# EAGLE design AteGates (EAGLE 6.6.0)
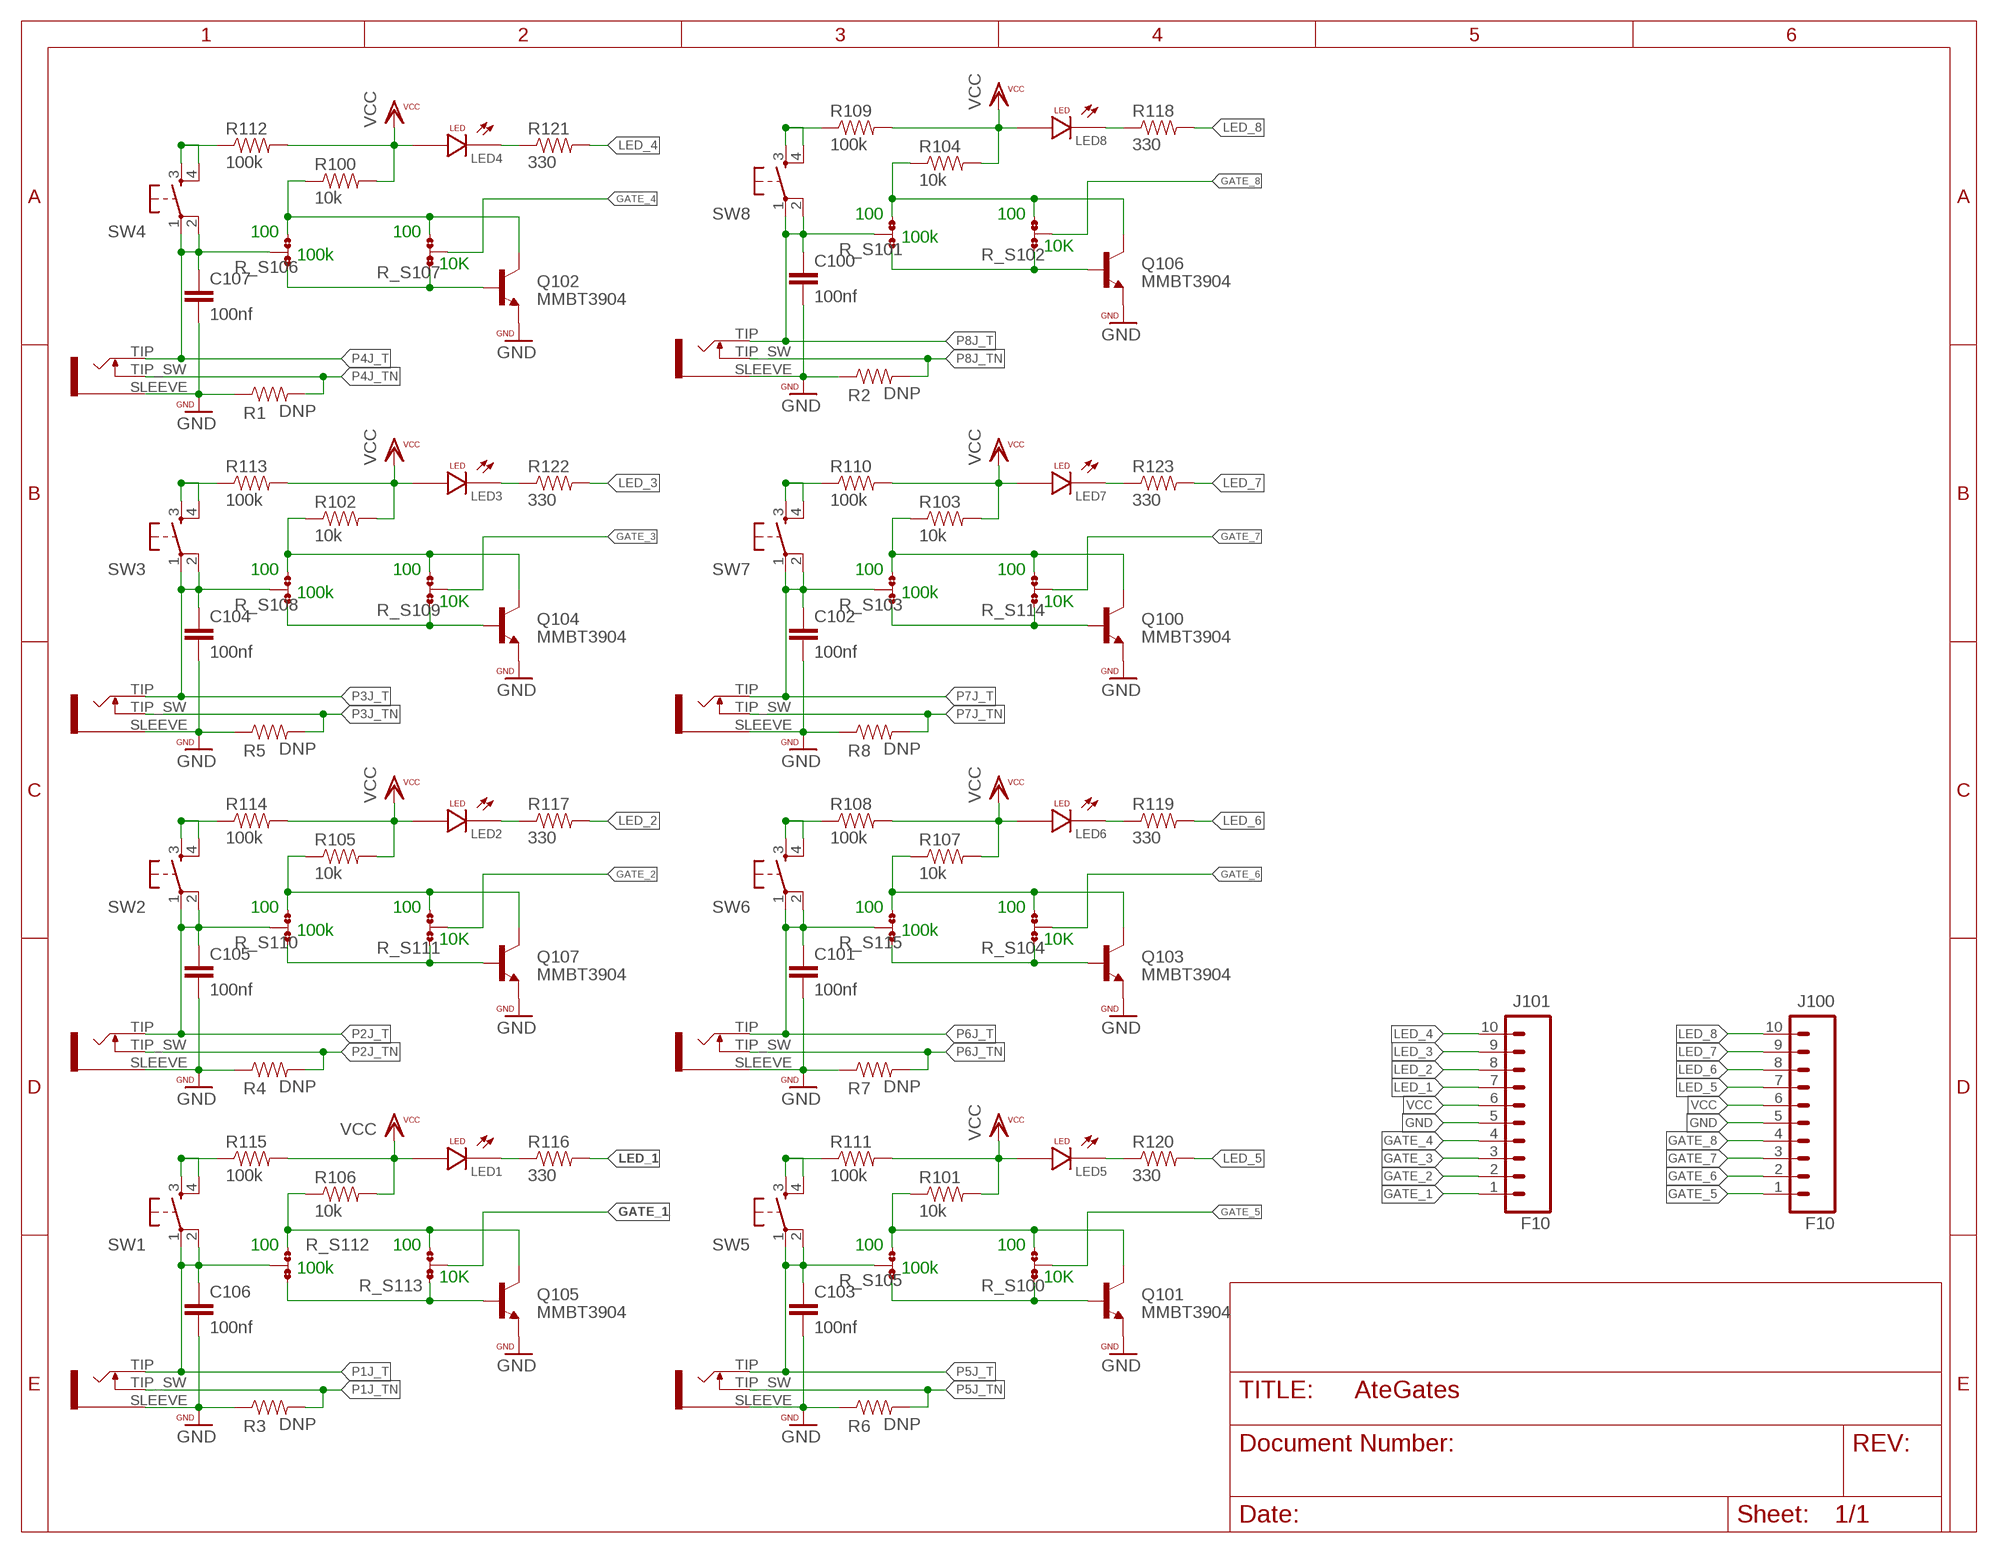
[diagram p0: schematic, sheet 1]

## Parts
C100  100nf  CAP0603-CAP  [0603-CAP]
C101  100nf  CAP0603-CAP  [0603-CAP]
C102  100nf  CAP0603-CAP  [0603-CAP]
C103  100nf  CAP0603-CAP  [0603-CAP]
C104  100nf  CAP0603-CAP  [0603-CAP]
C105  100nf  CAP0603-CAP  [0603-CAP]
C106  100nf  CAP0603-CAP  [0603-CAP]
C107  100nf  CAP0603-CAP  [0603-CAP]
J100  F10  M10SILK_FEMALE_PTH  [1X10_OCTO]
J101  F10  M10SILK_FEMALE_PTH  [1X10_OCTO]
LED1  LED  [LED3MM]
LED2  LED  [LED3MM]
LED3  LED  [LED3MM]
LED4  LED  [LED3MM]
LED5  LED  [LED3MM]
LED6  LED  [LED3MM]
LED7  LED  [LED3MM]
LED8  LED  [LED3MM]
P1J  JACK-3_5MM-MONO-SW-WQP_PJ302-12  [WQP_PJ301M-12]
P2J  JACK-3_5MM-MONO-SW-WQP_PJ302-12  [WQP_PJ301M-12]
P3J  JACK-3_5MM-MONO-SW-WQP_PJ302-12  [WQP_PJ301M-12]
P4J  JACK-3_5MM-MONO-SW-WQP_PJ302-12  [WQP_PJ301M-12]
P5J  JACK-3_5MM-MONO-SW-WQP_PJ302-12  [WQP_PJ301M-12]
P6J  JACK-3_5MM-MONO-SW-WQP_PJ302-12  [WQP_PJ301M-12]
P7J  JACK-3_5MM-MONO-SW-WQP_PJ302-12  [WQP_PJ301M-12]
P8J  JACK-3_5MM-MONO-SW-WQP_PJ302-12  [WQP_PJ301M-12]
Q100  MMBT3904  MMBT3904LT1-NPN-SOT23-BEC  [SOT23-BEC]
Q101  MMBT3904  MMBT3904LT1-NPN-SOT23-BEC  [SOT23-BEC]
Q102  MMBT3904  MMBT3904LT1-NPN-SOT23-BEC  [SOT23-BEC]
Q103  MMBT3904  MMBT3904LT1-NPN-SOT23-BEC  [SOT23-BEC]
Q104  MMBT3904  MMBT3904LT1-NPN-SOT23-BEC  [SOT23-BEC]
Q105  MMBT3904  MMBT3904LT1-NPN-SOT23-BEC  [SOT23-BEC]
Q106  MMBT3904  MMBT3904LT1-NPN-SOT23-BEC  [SOT23-BEC]
Q107  MMBT3904  MMBT3904LT1-NPN-SOT23-BEC  [SOT23-BEC]
R1  DNP  RESISTOR0603-RES  [0603-RES]
R2  DNP  RESISTOR0603-RES  [0603-RES]
R3  DNP  RESISTOR0603-RES  [0603-RES]
R4  DNP  RESISTOR0603-RES  [0603-RES]
R5  DNP  RESISTOR0603-RES  [0603-RES]
R6  DNP  RESISTOR0603-RES  [0603-RES]
R7  DNP  RESISTOR0603-RES  [0603-RES]
R8  DNP  RESISTOR0603-RES  [0603-RES]
R100  10k  RESISTOR0603-RES  [0603-RES]
R101  10k  RESISTOR0603-RES  [0603-RES]
R102  10k  RESISTOR0603-RES  [0603-RES]
R103  10k  RESISTOR0603-RES  [0603-RES]
R104  10k  RESISTOR0603-RES  [0603-RES]
R105  10k  RESISTOR0603-RES  [0603-RES]
R106  10k  RESISTOR0603-RES  [0603-RES]
R107  10k  RESISTOR0603-RES  [0603-RES]
R108  100k  RESISTOR0603-RES  [0603-RES]
R109  100k  RESISTOR0603-RES  [0603-RES]
R110  100k  RESISTOR0603-RES  [0603-RES]
R111  100k  RESISTOR0603-RES  [0603-RES]
R112  100k  RESISTOR0603-RES  [0603-RES]
R113  100k  RESISTOR0603-RES  [0603-RES]
R114  100k  RESISTOR0603-RES  [0603-RES]
R115  100k  RESISTOR0603-RES  [0603-RES]
R116  330  RESISTOR0603-RES  [0603-RES]
R117  330  RESISTOR0603-RES  [0603-RES]
R118  330  RESISTOR0603-RES  [0603-RES]
R119  330  RESISTOR0603-RES  [0603-RES]
R120  330  RESISTOR0603-RES  [0603-RES]
R121  330  RESISTOR0603-RES  [0603-RES]
R122  330  RESISTOR0603-RES  [0603-RES]
R123  330  RESISTOR0603-RES  [0603-RES]
R_S100  JMP-3-NO-0603  [JMP-3-NO-0603]
R_S101  100  JMP-3-NO-0603  [JMP-3-NO-0603]
R_S102  JMP-3-NO-0603  [JMP-3-NO-0603]
R_S103  100  JMP-3-NO-0603  [JMP-3-NO-0603]
R_S104  JMP-3-NO-0603  [JMP-3-NO-0603]
R_S105  100  JMP-3-NO-0603  [JMP-3-NO-0603]
R_S106  100  JMP-3-NO-0603  [JMP-3-NO-0603]
R_S107  JMP-3-NO-0603  [JMP-3-NO-0603]
R_S108  100  JMP-3-NO-0603  [JMP-3-NO-0603]
R_S109  JMP-3-NO-0603  [JMP-3-NO-0603]
R_S110  100  JMP-3-NO-0603  [JMP-3-NO-0603]
R_S111  JMP-3-NO-0603  [JMP-3-NO-0603]
R_S112  100  JMP-3-NO-0603  [JMP-3-NO-0603]
R_S113  JMP-3-NO-0603  [JMP-3-NO-0603]
R_S114  JMP-3-NO-0603  [JMP-3-NO-0603]
R_S115  100  JMP-3-NO-0603  [JMP-3-NO-0603]
SW1  TAC_SWITCHPTH  [TACTILE-PTH]
SW2  TAC_SWITCHPTH  [TACTILE-PTH]
SW3  TAC_SWITCHPTH  [TACTILE-PTH]
SW4  TAC_SWITCHPTH  [TACTILE-PTH]
SW5  TAC_SWITCHPTH  [TACTILE-PTH]
SW6  TAC_SWITCHPTH  [TACTILE-PTH]
SW7  TAC_SWITCHPTH  [TACTILE-PTH]
SW8  TAC_SWITCHPTH  [TACTILE-PTH]

## Nets
GATE_1: J101.1 R_S113.2
GATE_2: J101.2 R_S111.2
GATE_3: J101.3 R_S109.2
GATE_4: J101.4 R_S107.2
GATE_5: J100.1 R_S100.2
GATE_6: J100.2 R_S104.2
GATE_7: J100.3 R_S114.2
GATE_8: J100.4 R_S102.2
GND: C100.2 C101.2 C102.2 C103.2 C104.2 C105.2 C106.2 C107.2 J100.5 J101.5 P1J.SLEEVE P2J.SLEEVE P3J.SLEEVE P4J.SLEEVE P5J.SLEEVE P6J.SLEEVE P7J.SLEEVE P8J.SLEEVE Q100.E Q101.E Q102.E Q103.E Q104.E Q105.E Q106.E Q107.E R1.1 R2.1 R3.1 R4.1 R5.1 R6.1 R7.1 R8.1
GTI_1_LEDK: LED1.K(CATHODE) R116.1
GTI_1_LEDK1: LED2.K(CATHODE) R117.1
GTI_1_LEDK2: LED3.K(CATHODE) R122.1
GTI_1_LEDK3: LED4.K(CATHODE) R121.1
GTI_1_LEDK4: LED5.K(CATHODE) R120.1
GTI_1_LEDK5: LED6.K(CATHODE) R119.1
GTI_1_LEDK6: LED7.K(CATHODE) R123.1
GTI_1_LEDK7: LED8.K(CATHODE) R118.1
LED_1: J101.7 R116.2
LED_2: J101.8 R117.2
LED_3: J101.9 R122.2
LED_4: J101.10 R121.2
LED_5: J100.7 R120.2
LED_6: J100.8 R119.2
LED_7: J100.9 R123.2
LED_8: J100.10 R118.2
P1J_T: C106.1 P1J.TIP R_S112.2 SW1.1 SW1.2
P1J_TN: P1J.TIP_SW R3.2
P2J_T: C105.1 P2J.TIP R_S110.2 SW2.1 SW2.2
P2J_TN: P2J.TIP_SW R4.2
P3J_T: C104.1 P3J.TIP R_S108.2 SW3.1 SW3.2
P3J_TN: P3J.TIP_SW R5.2
P4J_T: C107.1 P4J.TIP R_S106.2 SW4.1 SW4.2
P4J_TN: P4J.TIP_SW R1.2
P5J_T: C103.1 P5J.TIP R_S105.2 SW5.1 SW5.2
P5J_TN: P5J.TIP_SW R6.2
P6J_T: C101.1 P6J.TIP R_S115.2 SW6.1 SW6.2
P6J_TN: P6J.TIP_SW R7.2
P7J_T: C102.1 P7J.TIP R_S103.2 SW7.1 SW7.2
P7J_TN: P7J.TIP_SW R8.2
P8J_T: C100.1 P8J.TIP R_S101.2 SW8.1 SW8.2
P8J_TN: P8J.TIP_SW R2.2
Q1_B: Q105.B R_S112.3 R_S113.3
Q1_B1: Q107.B R_S110.3 R_S111.3
Q1_B2: Q104.B R_S108.3 R_S109.3
Q1_B3: Q102.B R_S106.3 R_S107.3
Q1_B4: Q101.B R_S100.3 R_S105.3
Q1_B5: Q103.B R_S104.3 R_S115.3
Q1_B6: Q100.B R_S103.3 R_S114.3
Q1_B7: Q106.B R_S101.3 R_S102.3
Q1_C: Q105.C R106.1 R_S112.1 R_S113.1
Q1_C1: Q107.C R105.1 R_S110.1 R_S111.1
Q1_C2: Q104.C R102.1 R_S108.1 R_S109.1
Q1_C3: Q102.C R100.1 R_S106.1 R_S107.1
Q1_C4: Q101.C R101.1 R_S100.1 R_S105.1
Q1_C5: Q103.C R107.1 R_S104.1 R_S115.1
Q1_C6: Q100.C R103.1 R_S103.1 R_S114.1
Q1_C7: Q106.C R104.1 R_S101.1 R_S102.1
SW1: R115.1 SW1.3 SW1.4
SW2: R114.1 SW2.3 SW2.4
SW3: R113.1 SW3.3 SW3.4
SW4: R112.1 SW4.3 SW4.4
SW5: R111.1 SW5.3 SW5.4
SW6: R108.1 SW6.3 SW6.4
SW7: R110.1 SW7.3 SW7.4
SW8: R109.1 SW8.3 SW8.4
VCC: J100.6 J101.6 LED1.A(ANODE) LED2.A(ANODE) LED3.A(ANODE) LED4.A(ANODE) LED5.A(ANODE) LED6.A(ANODE) LED7.A(ANODE) LED8.A(ANODE) R100.2 R101.2 R102.2 R103.2 R104.2 R105.2 R106.2 R107.2 R108.2 R109.2 R110.2 R111.2 R112.2 R113.2 R114.2 R115.2

## Notes on the sheet
- 100 | 100
- 100 | 100
- 100k
- 10K
- 100k
- 10K
- 100 | 100 | 100 | 100
- 100k | 100k
- 10K | 10K
- 100 | 100 | 100 | 100
- 100k | 100k
- 10K | 10K
- 100 | 100 | 100 | 100
- 100k | 100k
- 10K | 10K

## Library data of the parts
C100-C107 = PatternAgents-ProtoPads:CAP: Capacitor Standard 0603 ceramic capacitor, and 0.1" leaded capacitor.
J100 J101 = oXo_Connectors:M10: Header 10 Standard 10-pin 0.1" header. Use with straight break away headers (SKU : PRT-00116), right angle break away headers (PRT-00553), swiss pins (PRT-00743), machine pins (PRT-00117), and female headers (PRT-00115).; PROD_ID: CONN-11563
LED1-LED8 = halcyonmod_Optoelectronics:LED
P1J P2J P3J P4J P5J P6J P7J P8J = oXo_Connectors:JACK-3_5MM-MONO-SW: Jack, 3.5mm, RIght Angle, Though-Hole
Q100-Q107 = transistor:*-NPN-: NPN Transistror BF959 corrected 2008.03.06
R1-R8 R100-R123 = PatternAgents-ProtoPads:RESISTOR: Resistor Basic schematic elements and footprints for 0603, 1206, and PTH resistors.
R_S100-R_S115 = PatternAgents-ProtoPads:JMP-3-NO: Three Terminal Jumper - Normally Open All Pads Open (unconnected) PatternAgents ProtoPads Library Schematic and PCB layout libraries for design patterns by PatternAgents. For the CADSoft Eagle CAD program : http://www.cadsoftusa.com/download-eagle/ Source LBR : http://www.patternagents.com Github : https://github.com/PatternAgents License : http://creativecommons.org/licenses/by-sa/4.0/ (Creative Commons 4.0) THIS SOFTWARE IS PROVIDED BY THE CONTRIBUTORS "AS IS" AND WITHOUT ANY EXPRESS OR IMPLIED WARRANTIES, INCLUDING, BUT NOT LIMITED TO, THE IMPLIED WARRANTIES OF MERCHANTABILITY AND FITNESS FOR A PARTICULAR PURPOSE ARE DISCLAIMED. IN NO EVENT SHALL THE COPYRIGHT OWNER OR CONTRIBUTORS BE LIABLE FOR ANY DIRECT, INDIRECT, INCIDENTAL, SPECIAL, EXEMPLARY, OR CONSEQUENTIAL DAMAGES (INCLUDING, BUT NOT LIMITED TO, PROCUREMENT OF SUBSTITUTE GOODS OR SERVICES; LOSS OF USE, DATA, OR PROFITS; OR BUSINESS INTERRUPTION) HOWEVER CAUSED AND ON ANY THEORY OF LIABILITY, WHETHER IN CONTRACT, STRICT LIABILITY, OR TORT (INCLUDING NEGLIGENCE OR OTHERWISE) ARISING IN ANY WAY OUT OF THE USE OF THIS SOFTWARE, EVEN IF ADVISED OF THE POSSIBILITY OF SUCH DAMAGE.; BOM: EXCLUDE
SW1-SW8 = SparkFun:TAC_SWITCH: Momentary Switch Button commonly used for reset or general input. Spark Fun Electronics SKU : COM-00097

## Board
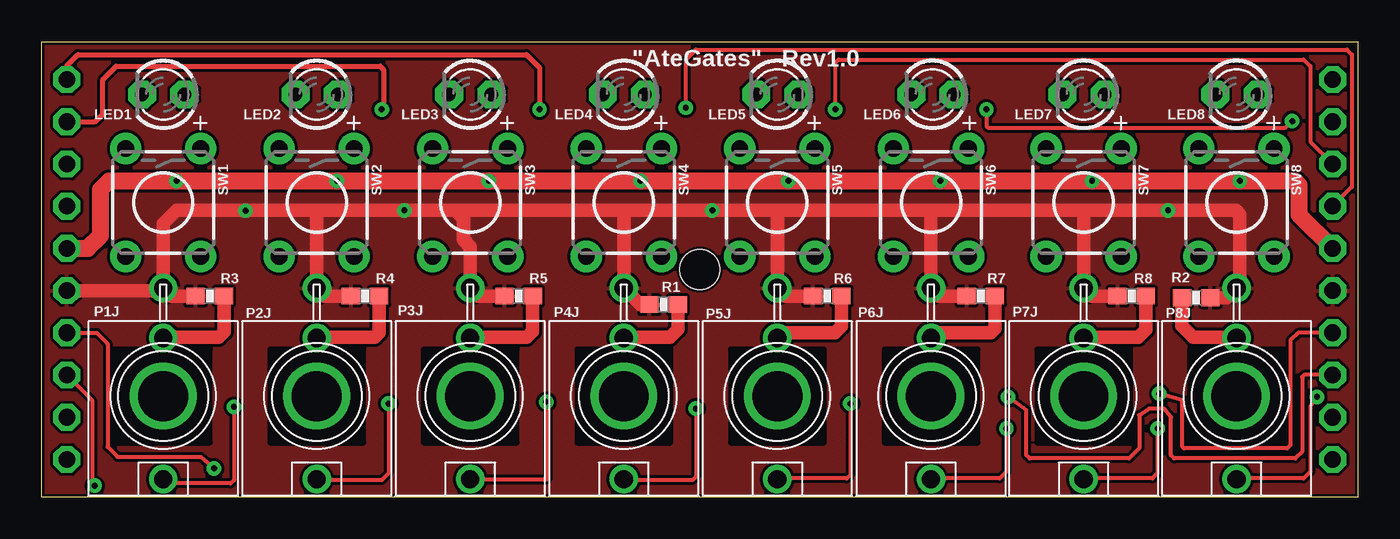
[diagram p1: board, top side]
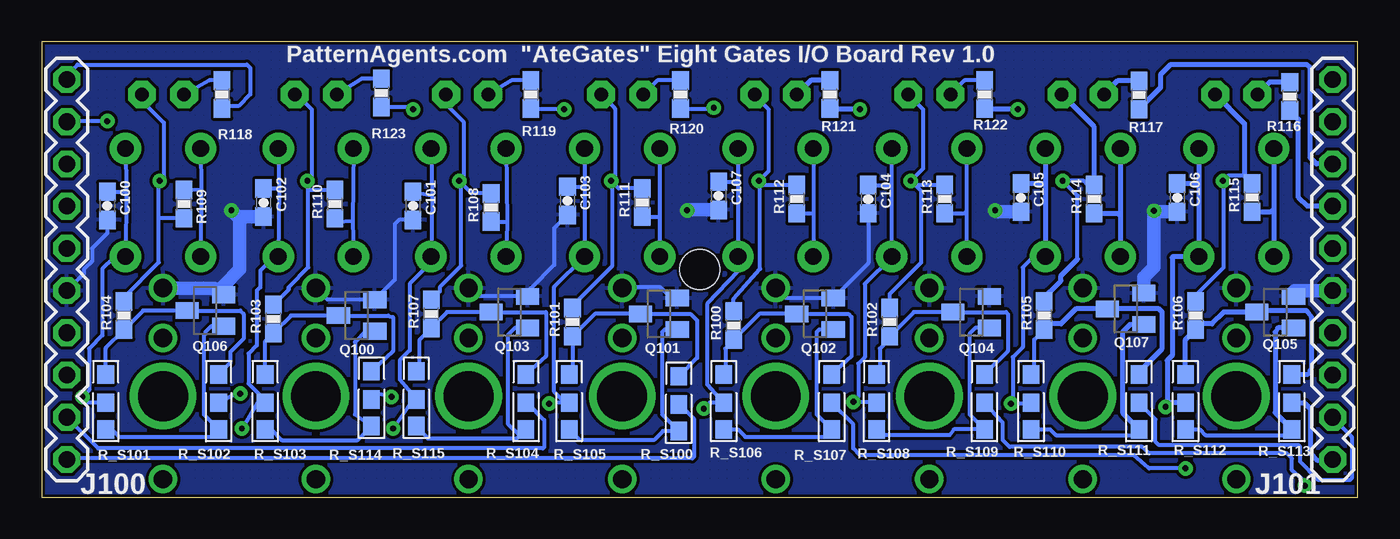
[diagram p2: board, bottom side, seen from below]

Size 79.25 x 27.43 mm. Coordinates in mm from the lower left corner, seen from the top.
Outline: 79.25,0 0,0 0,27.43 79.25,27.43 79.25,0
Copper layers (1*16): Top 0.035mm / dielectric 1.5mm / Bottom 0.035mm
Design rules "PatternAgents_7mil": minimum track width 7mil, minimum drill 14mil, track to track 7mil, track to pad 7mil, pad to pad 7mil, via to via 7mil, smd to smd 7mil, copper to edge 7mil, drill to drill 7mil, minimum pad ring 12mil, minimum via ring 10mil, stop-mask expansion 4mil, vias tented up to drill 25mil, thermal gap 7mil
Holes 2.4 mm at 39.62,13.72

### Footprints (pad centres in the part's own frame; a part is rotated, then mirrored left to right if it is on the bottom)
0603-CAP = smd 1.1 x 1: 1 -0.85,0; 2 0.85,0
1X10_OCTO = drill 1 octagon: 1 0,0; 2 2.54,0; 3 5.08,0; 4 7.62,0; 5 10.16,0; 6 12.7,0; 7 15.24,0; 8 17.78,0; 9 20.32,0; 10 22.86,0
LED3MM = drill 0.813 pad 1.676 octagon: A -1.27,0; K 1.27,0
WQP_PJ301M-12 = drill 3: HOLE 0,0 | drill 1.1: SLEEVE 0,-6.5; TIP 0,5; TIP_SW 0,-3.5
SOT23-BEC = smd 1 x 1.4: B -0.95,-1.1; C 0,1.1; E 0.95,-1.1
0603-RES = smd 1.1 x 1: 1 -0.85,0; 2 0.85,0
JMP-3-NO-0603 = smd 1.1 x 1: 1 -0.85,0; 2 0.85,0; 3 2.452,0
TACTILE-PTH = drill 1.016 pad 1.88: 1 -3.251,2.261; 2 3.251,2.261; 3 -3.251,-2.261; 4 3.251,-2.261

### Placement (x,y rotation side)
C100  75.28,17.55 270 bottom
C101  56.88,17.55 270 bottom
C102  65.88,17.75 270 bottom
C103  47.58,17.85 270 bottom
C104  29.48,17.95 270 bottom
C105  20.28,18.05 270 bottom
C106  10.88,18.05 270 bottom
C107  38.48,18.15 270 bottom
J100  77.72,2.29 90 bottom
J101  1.52,2.29 90 bottom
LED1  7.32,24.25 180 top
LED2  16.56,24.25 180 top
LED3  25.8,24.25 180 top
LED4  35.05,24.25 180 top
LED5  44.29,24.25 180 top
LED6  53.63,24.25 180 top
LED7  62.73,24.25 180 top
LED8  71.93,24.25 180 top
P1J  7.32,6.1 180 top
P2J  16.56,6.1 180 top
P3J  25.8,6.1 180 top
P4J  35.05,6.1 180 top
P5J  44.29,6.1 180 top
P6J  53.54,6.1 180 top
P7J  62.73,6.1 180 top
P8J  71.93,6.1 180 top
Q100  60.28,10.95 90 bottom
Q101  42.08,11.05 90 bottom
Q102  32.68,11.05 90 bottom
Q103  51.08,11.15 90 bottom
Q104  23.28,11.15 90 bottom
Q105  4.98,11.15 90 bottom
Q106  69.38,11.25 90 bottom
Q107  13.98,11.35 90 bottom
R1  37.45,11.6 0 top
R2  69.5,12.02 180 top
R3  10.14,12.11 0 top
R4  19.48,12.11 0 top
R5  28.72,12.11 0 top
R6  47.3,12.11 0 top
R7  56.55,12.11 0 top
R8  65.63,12.11 0 top
R100  37.58,10.35 90 bottom
R101  47.28,10.55 90 bottom
R102  28.18,10.55 90 bottom
R103  65.28,10.75 90 bottom
R104  74.28,10.95 90 bottom
R105  18.88,10.95 90 bottom
R106  9.78,10.95 90 bottom
R107  55.78,11.05 90 bottom
R108  52.18,17.45 90 bottom
R109  70.68,17.65 270 bottom
R110  61.58,17.65 90 bottom
R111  43.08,17.75 90 bottom
R112  33.78,17.95 90 bottom
R113  24.88,17.95 90 bottom
R114  15.88,17.95 90 bottom
R115  6.38,18.05 90 bottom
R116  4.1,24.13 270 bottom
R117  13.19,24.21 270 bottom
R118  68.38,24.25 270 bottom
R119  49.78,24.25 270 bottom
R120  40.78,24.25 270 bottom
R121  31.78,24.25 270 bottom
R122  22.48,24.25 270 bottom
R123  58.78,24.35 270 bottom
R_S100  40.88,6.45 270 bottom
R_S101  75.38,6.55 270 bottom
R_S102  68.58,6.55 270 bottom
R_S103  65.78,6.55 270 bottom
R_S104  50.08,6.55 270 bottom
R_S105  47.48,6.55 270 bottom
R_S106  38.18,6.55 270 bottom
R_S107  31.68,6.55 270 bottom
R_S108  28.98,6.55 270 bottom
R_S109  22.48,6.55 270 bottom
R_S110  19.68,6.55 270 bottom
R_S111  13.18,6.55 270 bottom
R_S112  10.38,6.55 270 bottom
R_S113  3.98,6.55 270 bottom
R_S114  59.38,6.75 270 bottom
R_S115  56.68,6.75 270 bottom
SW1  7.32,17.75 270 top
SW2  16.56,17.75 270 top
SW3  25.8,17.75 270 top
SW4  35.05,17.75 270 top
SW5  44.29,17.75 270 top
SW6  53.54,17.75 270 top
SW7  62.73,17.75 270 top
SW8  71.93,17.75 270 top

### Tracks (layer width: path | path; a pad name or v marks a point on that pad's centre or on a via)
GATE_1
  Bottom 0.305: R_S113.2 3.23,5.7 2.88,5.35 2.88,2.65 2.48,2.25 1.56,2.25 J101.1
GATE_2
  Bottom 0.254: J101.2 1.52,4.79 0.38,3.65 0.38,1.15 0.48,1.05 2.38,1.05 3.48,2.15 3.48,3.05 3.58,3.15 11.98,3.15 12.18,3.35 12.18,4.7 R_S111.2
GATE_3  (via drill 0.36)
  Top 0.254: J101.3 3.05,5.84 3.05,0.76 v3.2,0.71
  Bottom 0.254: v3.2,0.71 3.2,0.96 3.98,1.65 3.98,2.35 4.28,2.65 12.58,2.65 12.98,3.05 20.98,3.05 21.38,3.45 21.38,4.5 R_S109.2
GATE_4  (via drill 0.36)
  Top 0.254: J101.4 3.32,9.91 3.98,9.25 3.98,3.05 4.58,2.45 9.58,2.45 v10.38,1.75
  Bottom 0.254: v10.38,1.75 12.58,1.75 13.48,2.55 29.98,2.55 30.38,2.95 30.38,4.4 R_S107.2
GATE_5
  Bottom 0.254: R_S100.2 40.83,5.6 39.98,4.75 39.98,2.45 40.08,2.35 77.58,2.35 J100.1
GATE_6
  Bottom 0.254: R_S104.2 50.03,5.7 48.98,4.65 48.98,3.05 49.08,2.95 75.84,2.95 J100.2
GATE_7  (via drill 0.36)
  Top 0.254: J100.3 76,7.37 75.88,7.25 75.88,2.75 75.48,2.35 68.18,2.35 67.98,2.55 67.98,4.85 67.58,5.35 66.68,5.35 66.08,4.95 66.08,2.95 65.48,2.35 59.48,2.35 59.28,2.55 59.28,5.25 v58.18,6.05
  Bottom 0.254: v58.18,6.05 59.03,6.25 R_S114.2
GATE_8  (via drill 0.36)
  Top 0.254: J100.4 75.64,9.91 75.18,9.45 75.18,3.15 74.98,2.95 68.78,2.95 68.68,3.05 68.68,5.85 v67.28,6.25
  Bottom 0.254: v67.28,6.25 67.53,6.25 R_S102.2
GND  (via drill 0.36)
  Top 0.178: 72.14,11.94 72.06,11.94
  Top 0.813: J101.5 7.17,12.45 P1J.SLEEVE | P1J.SLEEVE 7.32,16.47 8.13,17.27 12.26,17.27 v12.28,17.25 12.31,17.27 16.26,17.27 | R3.1 7.81,12.11 P1J.SLEEVE | 16.26,17.27 v21.84,17.27 24.89,17.27 | 24.89,17.27 34.8,17.27 | 34.8,17.27 v40.39,17.27 44.2,17.27 | 44.2,17.27 53.59,17.27 | 53.59,17.27 62.74,17.27 | 62.74,17.27 v67.82,17.27 71.88,17.27 72.14,17.02 72.14,12.8 P8J.SLEEVE 71.35,12.02 R2.1 | R8.1 63.22,12.11 P7J.SLEEVE 62.73,17.27 62.74,17.27 | R7.1 54.03,12.11 P6J.SLEEVE 53.54,17.22 53.59,17.27 | 44.2,17.27 44.29,17.17 P5J.SLEEVE 44.78,12.11 R6.1 | 34.8,17.27 35.05,17.02 P4J.SLEEVE 36.05,11.6 R1.1 | R4.1 17.05,12.11 P2J.SLEEVE 16.56,16.96 16.26,17.27 | 24.89,17.27 25.4,16.76 25.4,15.49 25.8,15.09 P3J.SLEEVE 26.29,12.11 R5.1
  Bottom 0.254: C104.2 29.48,14.1 Q102.E 34.45,12 P4J.SLEEVE | C103.2 48.38,16.2 48.38,14 49.78,12.6 49.78,12.3 Q103.E 53.04,12.1 P6J.SLEEVE | C101.2 57.73,16.7 57.98,16.45 57.98,13.1 Q100.E 62.03,11.9 P7J.SLEEVE | Q101.E 41.33,12 41.98,12.65 44.24,12.65 P5J.SLEEVE | C100.2 75.28,15.9 76.2,14.99 76.2,14.22 76.71,13.72 76.71,13.46 J100.5
  Bottom 0.813: Q107.E 12.88,13.25 12.28,13.85 v12.28,17.25 12.23,17.2 C106.2 | P8J.SLEEVE 68.88,12.6 68.48,12.2 Q106.E 68.28,12.74 67.31,13.72 67.31,16.76 v67.82,17.27 67.44,16.9 C102.2 | C107.2 40.36,17.3 v40.39,17.27 | Q105.E 3.88,12.37 3.81,12.45 J101.5 | C105.2 21.77,17.2 v21.84,17.27
  pour Bottom (isolate 0.178, hatched): 0,0 0,27.43 79.25,27.43 79.25,0
  pour Top (isolate 0.178, hatched): 0,0 0,27.43 79.25,27.43 79.25,0
GTI_1_LEDK
  Bottom 0.305: R116.1 5.32,24.98 LED1.K
GTI_1_LEDK1
  Bottom 0.305: R117.1 14.48,25.06 LED2.K
GTI_1_LEDK2
  Bottom 0.254: R122.1 23.68,25.1 LED3.K
GTI_1_LEDK3
  Bottom 0.305: R121.1 32.93,25.1 LED4.K
GTI_1_LEDK4
  Bottom 0.254: R120.1 42.17,25.1 LED5.K
GTI_1_LEDK5
  Bottom 0.254: R119.1 50.96,25.1 LED6.K
GTI_1_LEDK6
  Bottom 0.254: R123.1 59.96,25.2 LED7.K
GTI_1_LEDK7
  Bottom 0.254: R118.1 69.16,25.1 LED8.K
LED_1
  Bottom 0.305: J101.7 3.06,17.53 3.58,18.05 3.58,22.77 R116.2
LED_2
  Bottom 0.305: J101.8 2.5,20.07 2.88,20.45 2.88,25.85 3.08,26.05 11.28,26.05 11.88,25.45 11.88,24.67 R117.2
LED_3  (via drill 0.36)
  Top 0.305: J101.9 3.24,22.61 3.68,23.05 3.68,25.15 4.48,25.95 20.38,25.95 20.58,25.75 20.58,23.45 v20.48,23.35
  Bottom 0.305: v20.48,23.35 22.43,23.35 R122.2
LED_4  (via drill 0.36)
  Top 0.305: J101.10 1.52,25.99 2.18,26.65 29.18,26.65 29.98,25.85 v29.98,23.35
  Bottom 0.305: v29.98,23.35 31.73,23.35 R121.2
LED_5  (via drill 0.36)
  Top 0.254: v38.78,23.45 38.78,26.35 39.38,26.95 78.58,26.95 78.88,26.65 78.88,18.69 J100.7
  Bottom 0.254: R120.2 38.83,23.4 v38.78,23.45
LED_6  (via drill 0.36)
  Top 0.254: v47.78,23.35 47.78,26.15 47.98,26.35 75.98,26.35 76.38,25.95 76.38,21.41 J100.8
  Bottom 0.254: R119.2 47.83,23.4 v47.78,23.35
LED_7  (via drill 0.36)
  Top 0.254: v56.88,23.35 56.88,22.35 56.98,22.25 74.88,22.25 v75.28,22.65
  Bottom 0.254: R123.2 57.03,23.5 v56.88,23.35 | v75.28,22.65 77.68,22.65 J100.9
LED_8
  Bottom 0.254: J100.10 77.72,25.41 77.08,26.05 66.88,26.05 66.68,25.85 66.68,24.25 67.38,23.55 67.83,23.55 R118.2
P1J_T  (via drill 0.36)
  Top 0.254: v11.58,5.45 11.58,1.05 11.38,0.85 7.57,0.85 P1J.TIP
  Bottom 0.254: 11.43,5.7 11.43,5.6 v11.58,5.45
  Bottom 0.305: SW1.1 9.59,18.85 | 9.59,18.85 SW1.2 11.13,14.5 11.18,14.45 11.18,8.55 11.48,8.25 11.48,5.75 11.43,5.7 R_S112.2 | C106.1 9.63,18.9 9.59,18.85
P1J_TN
  Top 0.813: R3.2 10.99,9.97 10.67,9.65 7.38,9.65 P1J.TIP_SW
P2J_T  (via drill 0.36)
  Top 0.254: v20.88,5.65 20.88,1.45 20.48,1.05 16.61,1.05 P2J.TIP
  Bottom 0.254: 19.73,5.65 v20.88,5.65 20.78,5.75 20.78,8.45 20.18,9.05 20.18,13.85 19.53,14.5 19.03,14.5
  Bottom 0.305: SW2.1 18.83,18.85 | 18.83,18.85 SW2.2 19.03,14.5 | C105.1 18.88,18.9 18.83,18.85 | 19.73,5.65 R_S110.2
P2J_TN
  Top 0.813: R4.2 20.33,9.91 20.07,9.65 16.62,9.65 P2J.TIP_SW
P3J_T  (via drill 0.36)
  Top 0.254: P3J.TIP 30.43,1.1 30.48,1.15 30.48,5.65 v30.38,5.75
  Bottom 0.254: R_S108.2 29.03,5.75 v30.38,5.75 30.08,6.05 30.08,8.05 29.68,8.45 29.68,12.85 28.06,14.46 SW3.2 28.06,18.95 | 28.06,18.95 SW3.1 | C104.1 28.22,18.8 28.06,18.95
P3J_TN
  Top 0.813: R5.2 29.57,10.01 29.21,9.65 25.86,9.65 P3J.TIP_SW
P4J_T  (via drill 0.36)
  Top 0.254: v39.38,5.35 39.38,1.25 39.18,1.05 35.1,1.05 P4J.TIP
  Bottom 0.254: SW4.1 37.32,19.05 | 37.32,19.05 SW4.2 37.32,13.62 39.18,11.65 39.18,6.8 R_S106.2 39.03,5.7 v39.38,5.35 | C107.1 37.37,19 37.32,19.05
P4J_TN
  Top 0.813: R1.2 38.3,10.11 37.85,9.65 35.11,9.65 P4J.TIP_SW
P5J_T  (via drill 0.36)
  Top 0.254: v48.68,5.65 48.68,1.35 48.48,1.15 44.34,1.15 P5J.TIP
  Bottom 0.254: SW5.1 46.55,18.55 | 46.55,18.55 SW5.2 48.38,12.67 48.38,6.35 47.73,5.7 R_S105.2 48.63,5.7 v48.68,5.65 | C103.1 46.7,18.7 46.55,18.55
P5J_TN
  Top 0.813: R6.2 48.15,10.31 47.75,9.91 44.6,9.91 P5J.TIP_SW
P6J_T  (via drill 0.36)
  Top 0.254: v58.08,4.15 58.08,1.55 57.68,1.15 53.59,1.15 P6J.TIP
  Bottom 0.254: SW6.1 55.75,18.15 | 55.75,18.15 SW6.2 55.94,14.29 55.94,14 57.08,12.85 57.08,8.85 57.68,8.25 57.68,7.1 R_S115.2 | C101.1 55.8,18.2 55.75,18.15 | R_S115.2 57.03,5.7 v58.08,4.15 | R_S115.2 56.78,5.85
P6J_TN
  Top 0.813: R7.2 57.4,10.15 57.15,9.91 53.85,9.91 P6J.TIP_SW
P7J_T  (via drill 0.36)
  Top 0.254: v67.18,4.15 67.18,1.45 66.88,1.15 62.78,1.15 P7J.TIP
  Bottom 0.254: SW7.1 64.94,18.65 | 64.94,18.65 SW7.2 65.43,14.29 66.08,13.65 66.08,12.65 66.28,12.45 66.28,9.15 66.78,8.65 66.78,6.85 65.78,5.85 R_S103.2 66.23,5.7 v67.18,4.15 | C102.1 65.19,18.6 64.94,18.65
P7J_TN
  Top 0.813: R8.2 66.48,10.1 66.04,9.65 62.79,9.65 P7J.TIP_SW
P8J_T  (via drill 0.36)
  Top 0.254: v76.78,6.05 76.68,6.05 76.38,5.45 76.38,1.55 75.98,1.15 71.98,1.15 P8J.TIP
  Bottom 0.254: SW8.1 74.14,18.45 | 74.14,18.45 SW8.2 74.93,14.39 75.58,13.75 75.58,9.75 76.38,8.95 76.38,6.45 v76.78,6.05 76.43,5.7 R_S101.2 | C100.1 74.39,18.4 74.14,18.45
P8J_TN
  Top 0.813: R2.2 68.65,10.34 69.34,9.65 71.88,9.65 P8J.TIP_SW
Q1_B
  Bottom 0.254: R_S112.3 9.53,4.09 9.18,3.75 4.33,3.75 R_S113.3
  Bottom 0.305: Q105.B 4.83,10.2 4.98,9.95 4.98,5.09 R_S113.3
Q1_B1
  Bottom 0.254: R_S110.3 18.53,4.09 18.18,3.75 13.53,3.75 R_S111.3
  Bottom 0.305: Q107.B 13.73,10.4 14.18,9.95 14.18,5.09 R_S111.3
Q1_B2
  Bottom 0.254: R_S108.3 28.74,3.75 24.58,3.75 24.34,4.09 R_S109.3 23.38,4.99 23.38,9.85 23.03,10.2 Q104.B
Q1_B3
  Bottom 0.254: Q102.B 32.43,10.1 32.58,9.95 32.58,4.99 R_S107.3 32.13,3.65 36.88,3.65 37.33,4.09 R_S106.3
Q1_B4
  Bottom 0.254: Q101.B 41.73,10.1 41.88,9.95 41.88,4.99 R_S100.3 41.84,3.99 42.38,3.45 46.84,3.45 R_S105.3
Q1_B5
  Bottom 0.254: Q103.B 50.73,10.2 51.18,9.75 51.18,4.45 50.48,3.75 50.43,3.75 R_S104.3 50.63,3.55 55.98,3.55 56.53,4.09 R_S115.3
Q1_B6
  Bottom 0.254: Q100.B 59.73,10 60.38,9.35 60.38,4.99 R_S114.3 60.23,3.45 64.78,3.45 65.43,4.09 R_S103.3
Q1_B7
  Bottom 0.254: Q106.B 69.03,10.3 69.38,9.95 69.38,9.85 69.48,9.75 69.48,4.99 R_S102.3 69.03,3.65 74.58,3.65 75.03,4.09 R_S101.3
Q1_C
  Bottom 0.305: R_S112.1 10.38,9.5 R106.1 9.43,10.45 8.78,10.45 8.08,11.15 Q105.C 5.98,11.25 3.08,11.25 2.78,10.85 2.78,7.85 2.88,7.65 2.88,7.55 3.03,7.4 R_S113.1
Q1_C1
  Bottom 0.178: 19.05,10.45 19.05,10.16 R105.1
  Bottom 0.254: 19.48,7.6 19.48,9.5 R105.1
  Bottom 0.305: 19.13,10.45 19.05,10.45 17.88,10.45 16.98,11.35 Q107.C 11.98,11.35 11.78,11.15 11.78,8.95 13.18,7.55 R_S111.1 | 19.48,7.6 R_S110.1
Q1_C2
  Bottom 0.254: R_S109.1 21.08,8.8 21.08,11.05 21.18,11.15 Q104.C 26.73,11.15 R102.1 28.18,9.55 28.78,8.95 28.78,7.6 R_S108.1
Q1_C3
  Bottom 0.254: R_S107.1 30.48,8.5 30.48,10.85 30.68,11.05 Q102.C 36.03,11.05 R100.1 37.58,9.45 38.08,8.95 38.08,7.5 R_S106.1
Q1_C4
  Bottom 0.254: R_S100.1 39.78,8.4 39.78,10.65 40.18,11.05 Q101.C 45.93,11.05 R101.1 47.28,7.6 R_S105.1
Q1_C5
  Bottom 0.254: R_S104.1 48.88,8.5 48.88,11.15 Q103.C 54.83,11.15 R107.1 56.48,9.5 56.48,7.7 R_S115.1
Q1_C6
  Bottom 0.254: R_S103.1 65.78,9.4 R103.1 64.23,10.95 Q100.C 58.38,10.95 58.08,10.85 58.08,8.8 R_S114.1
Q1_C7
  Bottom 0.254: R_S101.1 75.38,9 R104.1 73.13,11.25 Q106.C 67.28,11.25 67.08,11.05 67.08,9.55 67.88,8.75 67.88,8.1 R_S102.1
SW1
  Bottom 0.305: SW1.3 5.06,17.35 | 5.06,17.35 SW1.4 | R115.1 5.21,17.2 5.06,17.35
SW2
  Bottom 0.305: SW2.3 14.3,16.95 | 14.3,16.95 SW2.4 | R114.1 14.45,17.1 14.3,16.95
SW3
  Bottom 0.254: SW3.4 23.54,17.25 | 23.54,17.25 SW3.3 | R113.1 23.69,17.1 23.54,17.25
SW4
  Bottom 0.254: SW4.3 32.79,17.05 | 32.79,17.05 SW4.4 | R112.1 32.84,17.1 32.79,17.05
SW5
  Bottom 0.254: SW5.3 42.03,16.95 | 42.03,16.95 SW5.4 | R111.1 42.08,16.9 42.03,16.95
SW6
  Bottom 0.254: SW6.3 51.22,16.55 | 51.22,16.55 SW6.4 | R108.1 51.27,16.6 51.22,16.55
SW7
  Bottom 0.254: SW7.3 60.52,16.65 | 60.52,16.65 SW7.4 | R110.1 61.47,16.6 60.52,16.65
SW8
  Bottom 0.254: SW8.3 69.62,18.55 | 69.62,18.55 SW8.4 | R109.1 70.67,18.5 69.62,18.55
VCC  (via drill 0.36)
  Top 0.178: J101.6 1.72,14.99
  Top 1.016: 1.72,14.99 2.79,14.99 3.56,15.75 3.56,18.54 4.06,19.05 v8.13,19.05 v17.78,19.05 v26.92,19.05 v36.07,19.05 v44.96,19.05 v54.1,19.05 v63.25,19.05 v72.14,19.05 75.44,19.05 75.69,18.8 75.69,17.02 J100.6
  Bottom 0.254: R102.2 28.18,12.25 26.28,14.15 26.28,18.41 v26.92,19.05 | R100.2 37.58,11.95 35.98,13.75 35.98,18.97 v36.07,19.05 | LED3.A 26.18,23.35 26.18,19.79 v26.92,19.05 | LED4.A 36.32,24.19 35.48,23.35 35.48,19.63 v36.07,19.05 | LED5.A 44.73,23.42 44.73,19.27 v44.96,19.05 | R101.2 47.28,11.55 44.88,13.95 44.88,18.98 v44.96,19.05 | LED7.A 63.65,24.02 62.98,23.35 62.98,19.31 v63.25,19.05 63.18,18.99 63.18,18.54 | 9.78,12.05 9.78,12.15 8.08,13.85 8.08,19.01 v8.13,19.05 7.83,19.35 6.83,19.35 | R103.2 64.38,12.5 64.38,12.65 63.18,13.85 63.18,18.54 | R107.2 55.28,12.4 55.28,12.65 53.98,13.95 53.98,18.93 v54.1,19.05 | R104.2 74.28,12.05 72.18,14.15 72.18,16.76 | LED8.A 72.85,23.52 71.88,22.55 71.88,19.3 v72.14,19.05 72.18,19 72.18,16.76 | R109.2 72.15,16.8 72.18,16.76 | R110.2 63.14,18.5 63.18,18.54 | LED6.A 54.9,23.66 53.85,22.61 53.85,19.3 v54.1,19.05 | R108.2 53.35,18.3 v54.1,19.05 | R111.2 44.5,18.6 v44.96,19.05 | R112.2 35.81,18.8 v36.07,19.05 | 16.88,14.35 16.88,18.15 v17.78,19.05 16.51,19.05 16.26,18.8 R114.2 | R113.2 26.67,18.8 v26.92,19.05
  Bottom 0.305: LED1.A 6.83,22.49 6.83,19.35 R115.2 | R106.2 9.78,12.05 | R114.2 15.88,22.3 LED2.A | R105.2 19.13,11.8 17.88,13.05 17.88,13.35 16.88,14.35

### Text on the board
tPlace: "AteGates" Rev1.0
bPlace: PatternAgents.com "AteGates" Eight Gates I/O Board Rev 1.0